# EAGLE schematic NBMC_SCHEMATIC_with_LBM313 (EAGLE 6.6.0)
Schematic with LBM313 module with Thermistor and AD8232 analog front end for ECG measurement
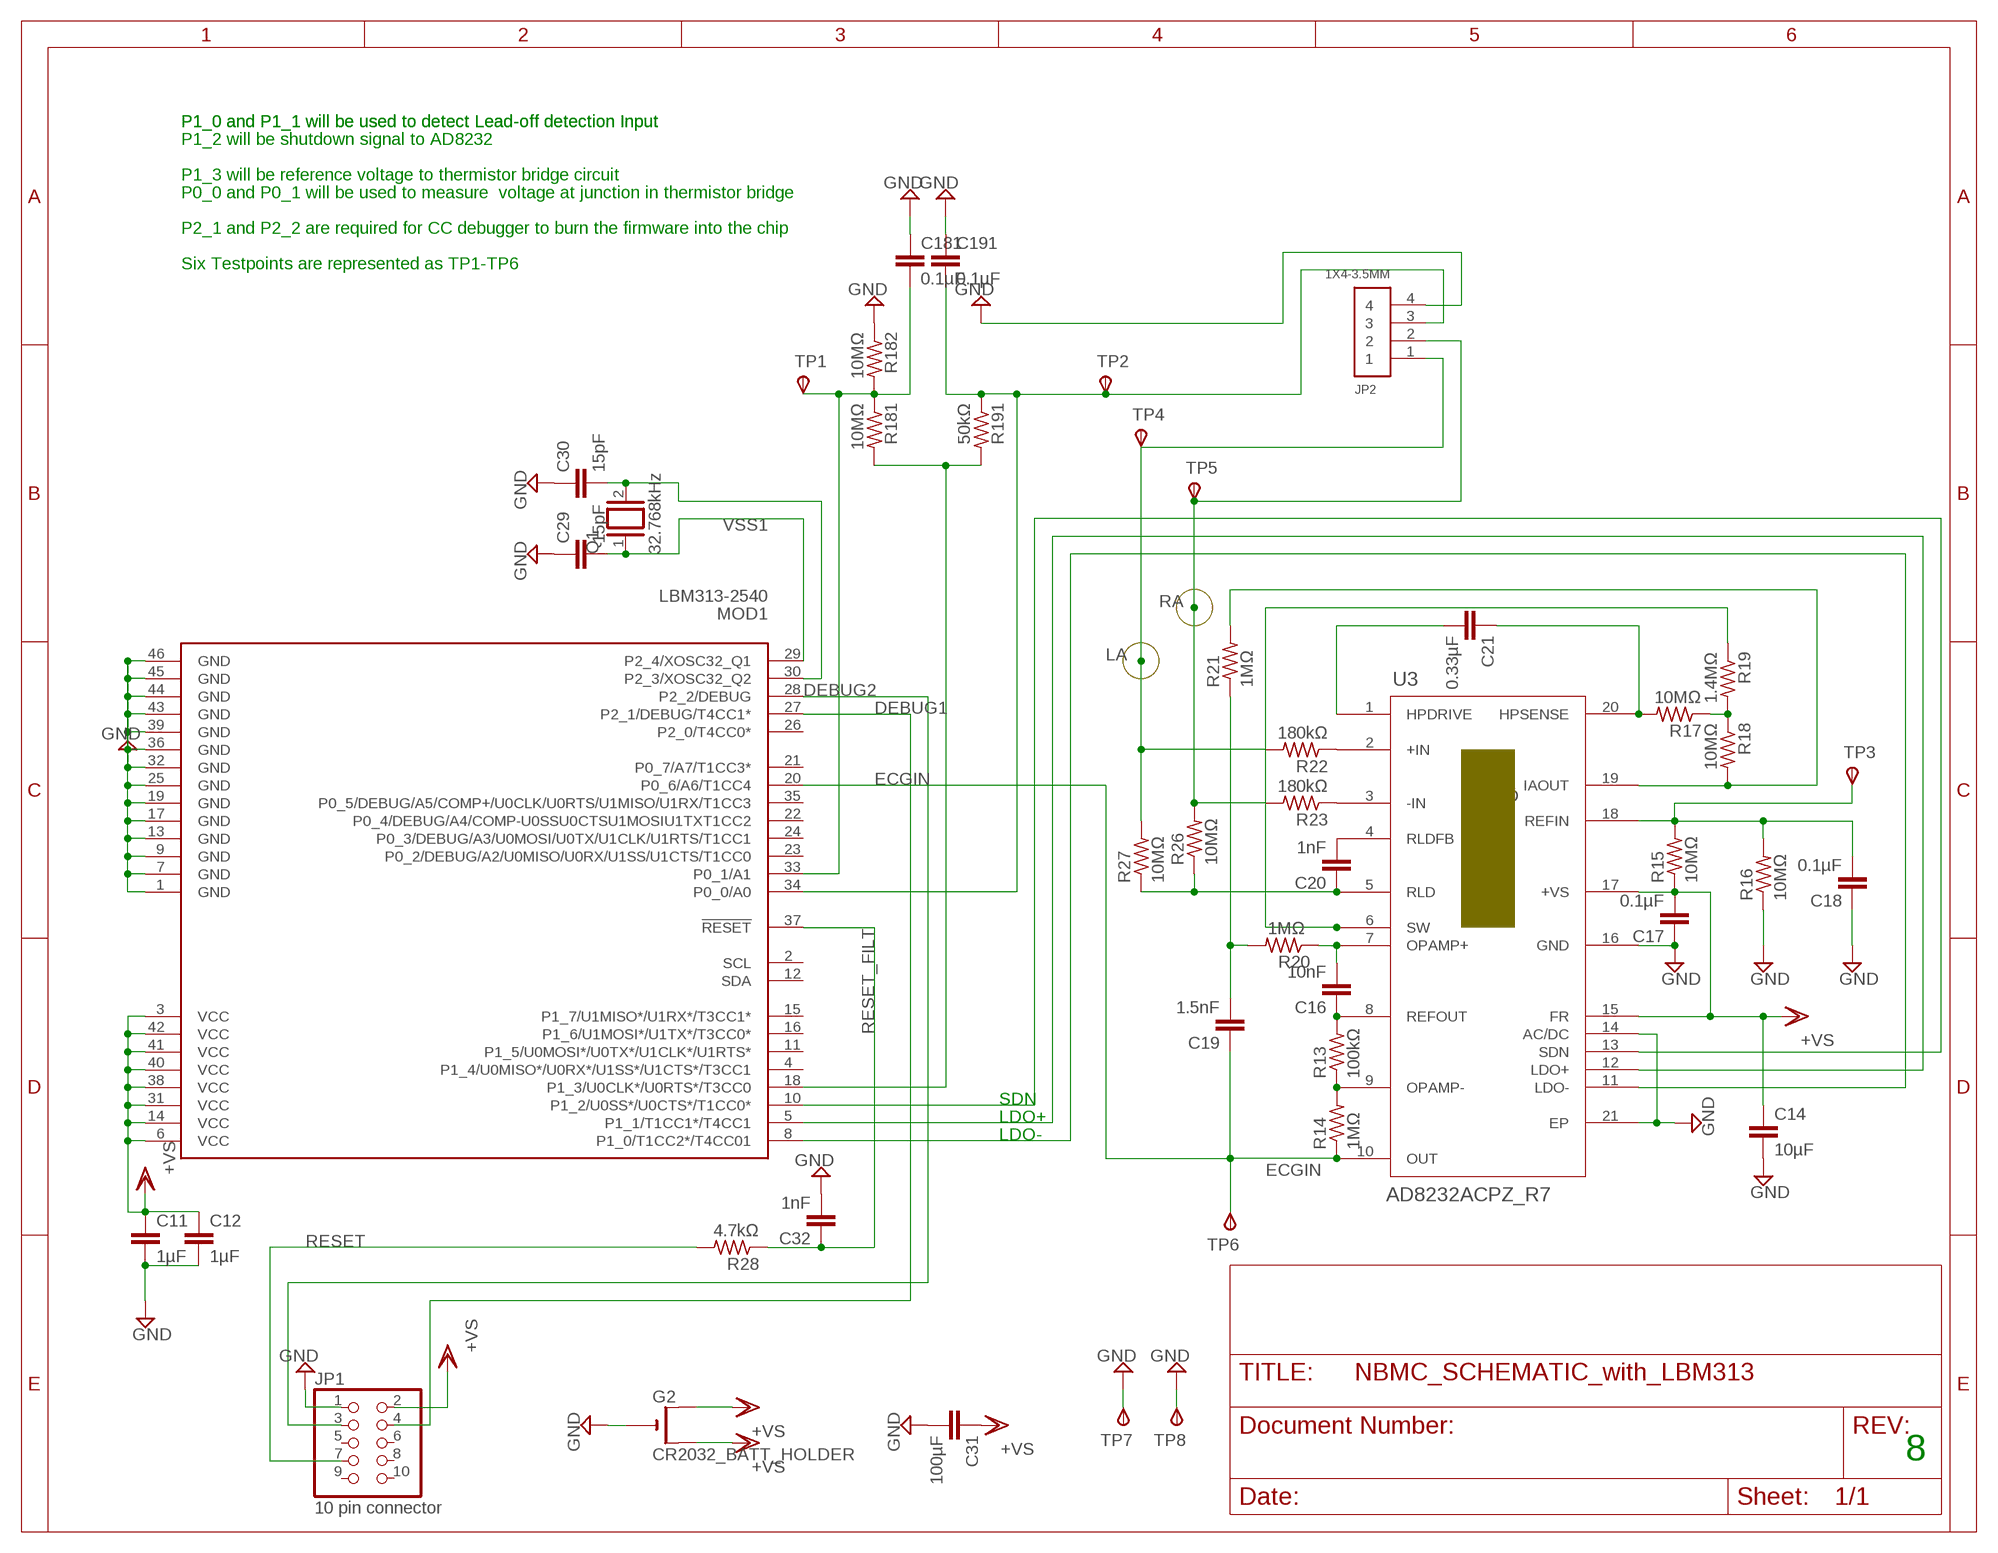
[diagram p0: schematic, sheet 1]

## Parts
C11  1µF  C-EUC0402  [C0402]
C12  1µF  C-EUC0402  [C0402]
C14  10µF  C-EUC0402  [C0402]
C16  10nF  C-EUC0402  [C0402]
C17  0.1µF  C-EUC0402  [C0402]
C18  0.1µF  C-EUC0402  [C0402]
C19  1.5nF  C-EUC0402  [C0402]
C20  1nF  C-EUC0402  [C0402]
C21  0.33µF  C-EUC0402  [C0402]
C29  15pF  C-EUC0402  [C0402]
C30  15pF  C-EUC0402  [C0402]
C31  100µF  C-EUC1210  [C1210]
C32  1nF  C-EUC0402  [C0402]
C181  0.1µF  C-EUC0402  [C0402]
C191  0.1µF  C-EUC0402  [C0402]
G2  CR2032_BATT_HOLDER  CR2032SMT  [CR2032-SMD]
JP1  10 pin connector  PINHD-2X5  [2X05]
JP2  1X4-3.5MM  [1X04-3.5MM]
MOD1  LBM313-2540  [LBM313-2540]
Q1  32.768kHz  XTAL  [Q]
R13  100kΩ  R-US_R0402  [R0402]
R14  1MΩ  R-US_R0402  [R0402]
R15  10MΩ  R-US_R0402  [R0402]
R16  10MΩ  R-US_R0402  [R0402]
R17  10MΩ  R-US_R0402  [R0402]
R18  10MΩ  R-US_R0402  [R0402]
R19  1.4MΩ  R-US_R0402  [R0402]
R20  1MΩ  R-US_R0402  [R0402]
R21  1MΩ  R-US_R0402  [R0402]
R22  180kΩ  R-US_R0402  [R0402]
R23  180kΩ  R-US_R0402  [R0402]
R26  10MΩ  R-US_R0402  [R0402]
R27  10MΩ  R-US_R0402  [R0402]
R28  4.7kΩ  R-US_R0402  [R0402]
R181  10MΩ  R-US_R0402  [R0402]
R182  10MΩ  R-US_R0402  [R0402]
R191  50kΩ  R-US_R0402  [R0402]
TP1  TPSTP09R  [TP09R]
TP2  TPSTP09R  [TP09R]
TP3  TPSTP09R  [TP09R]
TP4  TPSTP09R  [TP09R]
TP5  TPSTP09R  [TP09R]
TP6  TPSTP09R  [TP09R]
TP7  TPSTP09R  [TP09R]
TP8  TPSTP09R  [TP09R]
U3  AD8232ACPZ_R7  [CP_20_10]

## Nets
DEBUG1: JP1.4 MOD1.27(P2_1/DEBUG/T4CC1*)
DEBUG2: JP1.3 MOD1.28(P2_2/DEBUG)
ECGIN: C19.1 MOD1.20(P0_6/A6/T1CC4) R14.1 TP6.TP(PP) U3.10(OUT)
GND: C11.2 C12.2 C14.2 C17.1 C18.1 C29.1 C30.1 C31.2 C32.2 C181.1 C191.1 G2.2(GND) JP1.1 JP2.4 MOD1.1(GND) MOD1.7(GND) MOD1.9(GND) MOD1.13(GND) MOD1.17(GND) MOD1.19(GND) MOD1.25(GND) MOD1.32(GND) MOD1.36(GND) MOD1.39(GND) MOD1.43(GND) MOD1.44(GND) MOD1.45(GND) MOD1.46(GND) R16.1 R182.1 TP7.TP(PP) TP8.TP(PP) U3.14(AC/DC) U3.16(GND) U3.21(EP)
LA: JP2.1 R22.2 R27.2 TP4.TP(PP)
N$2: C30.2 MOD1.30(P2_3/XOSC32_Q2) Q1.2
N$15: R22.1 U3.2(+IN)
N$17: C20.1 R26.1 R27.1 U3.5(RLD)
N$21: R23.1 U3.3(-IN)
N$22: R19.1 U3.6(SW)
N$23: MOD1.18(P1_3/U0CLK*/U0RTS*/T3CC0) R181.2 R191.2
N$25: MOD1.8(P1_0/T1CC2*/T4CC01) U3.11(LDO-)
N$26: MOD1.5(P1_1/T1CC1*/T4CC1) U3.12(LDO+)
N$27: MOD1.10(P1_2/U0SS*/U0CTS*/T1CC0*) U3.13(SDN)
N$29: C19.2 R20.2 R21.1
N$37: R13.1 R14.2 U3.9(OPAMP-)
N$41: C16.2 R20.1 U3.7(OPAMP+)
N$42: C16.1 R13.2 U3.8(REFOUT)
N$49: R18.2 R21.2 U3.19(IAOUT)
N$50: C21.1 R17.2 U3.20(HPSENSE)
N$51: R17.1 R18.1 R19.2
N$54: C20.2 U3.4(RLDFB)
N$57: C21.2 U3.1(HPDRIVE)
RA: JP2.2 R23.2 R26.2 TP5.TP(PP)
RESET: JP1.7 R28.2
RESET_FILT: C32.1 MOD1.37(!RESET!) R28.1
TV1: C181.2 MOD1.33(P0_1/A1) R181.1 R182.2 TP1.TP(PP)
TV2: C191.2 JP2.3 MOD1.34(P0_0/A0) R191.1 TP2.TP(PP)
TV3: C18.2 R15.2 R16.2 TP3.TP(PP) U3.18(REFIN)
VSS: C11.1 C12.1 C14.1 C17.2 C31.1 G2.1(VS1) G2.3(VS2) JP1.2 MOD1.3(VCC) MOD1.6(VCC) MOD1.14(VCC) MOD1.31(VCC) MOD1.38(VCC) MOD1.40(VCC) MOD1.41(VCC) MOD1.42(VCC) R15.1 U3.15(FR) U3.17(+VS) ; supply symbol labelled +VS
VSS1: C29.2 MOD1.29(P2_4/XOSC32_Q1) Q1.1
Unconnected: JP1.5 JP1.6 JP1.8 JP1.9 JP1.10 MOD1.2(SCL) MOD1.4(P1_4/U0MISO*/U0RX*/U1SS*/U1CTS*/T3CC1) MOD1.11(P1_5/U0MOSI*/U0TX*/U1CLK*/U1RTS*) MOD1.12(SDA) MOD1.15(P1_7/U1MISO*/U1RX*/T3CC1*) MOD1.16(P1_6/U1MOSI*/U1TX*/T3CC0*) MOD1.21(P0_7/A7/T1CC3*) MOD1.22(P0_4/DEBUG/A4/COMP-U0SSU0CTSU1MOSIU1TXT1CC2) MOD1.23(P0_2/DEBUG/A2/U0MISO/U0RX/U1SS/U1CTS/T1CC0) MOD1.24(P0_3/DEBUG/A3/U0MOSI/U0TX/U1CLK/U1RTS/T1CC1) MOD1.26(P2_0/T4CC0*) MOD1.35(P0_5/DEBUG/A5/COMP+/U0CLK/U0RTS/U1MISO/U1RX/T1CC3)

## Notes on the sheet
- P1_0 and P1_1 will be used to detect Lead-off detection Input | P1_0 and P1_1 will be used to detect Lead-off detection Input
- P1_2 will be shutdown signal to AD8232
- P1_3 will be reference voltage to thermistor bridge circuit
- P0_0 and P0_1 will be used to measure  voltage at junction in thermistor bridge
- P2_1 and P2_2 are required for CC debugger to burn the firmware into the chip
- Six Testpoints are represented as TP1-TP6
- GND
  PAD
- SDN
- LDO+
- LDO-
- 8

## Library data of the parts
C11 C12 C14 C16-C21 C29 C30 C32 C181 C191 = rcl:C-EU: CAPACITOR, European symbol
C31 = resistor:C-EU: CAPACITOR, European symbol
G2 = adafruit:CR2032
JP1 = pinhead:PINHD-2X5: PIN HEADER
JP2 = adafruit:1X4: 4-pin connector
MOD1 = LBM313-2540:LBM313-2540: Bluetooth 4.0 Module. Documentation at: http://punchthrough.com/docs/doku.php?id=lbm313
Q1 = special:XTAL: CRYSTAL
R13-R23 R26-R28 R181 R182 R191 = rcl:R-US_: RESISTOR, American symbol
TP1-TP8 = testpad:TPS: TEST PIN
U3 = AD8232:AD8232ACPZ_R7